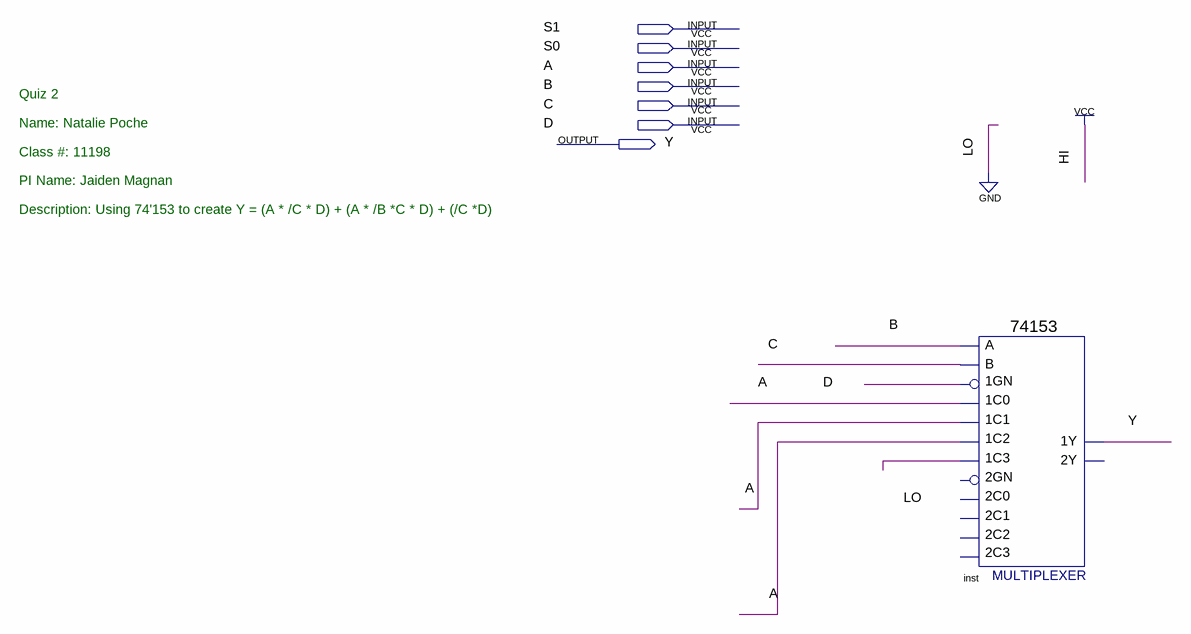
[diagram p0: schematic sheet]
// Quartus schematic quiz2.bdf as structural Verilog: 1 symbols, 7 pins
module quiz2 (
  input  S1,
  input  S0,
  input  A,
  input  B,
  input  C,
  input  D,
  output Y
);

  \74153  inst (
    .\1C1 (A), .\1GN (D), .\1C0 (A), .\1C2 (A), .\1C3 (1'b0), .B(C), .A(B), .\1Y (Y));  // open: 2C0, 2GN, 2C2, 2C1, 2C3, 2Y

  // Notes on the sheet:
  //   Quiz 2
  //   Name: Natalie Poche
  //   Class #: 11198
  //   PI Name: Jaiden Magnan
  //   Description: Using 74'153 to create Y = (A * /C * D) + (A * /B *C * D) + (/C *D)
endmodule
